# EAGLE schematic Quad (EAGLE 9.5.1)

## Sheet 1 of 2
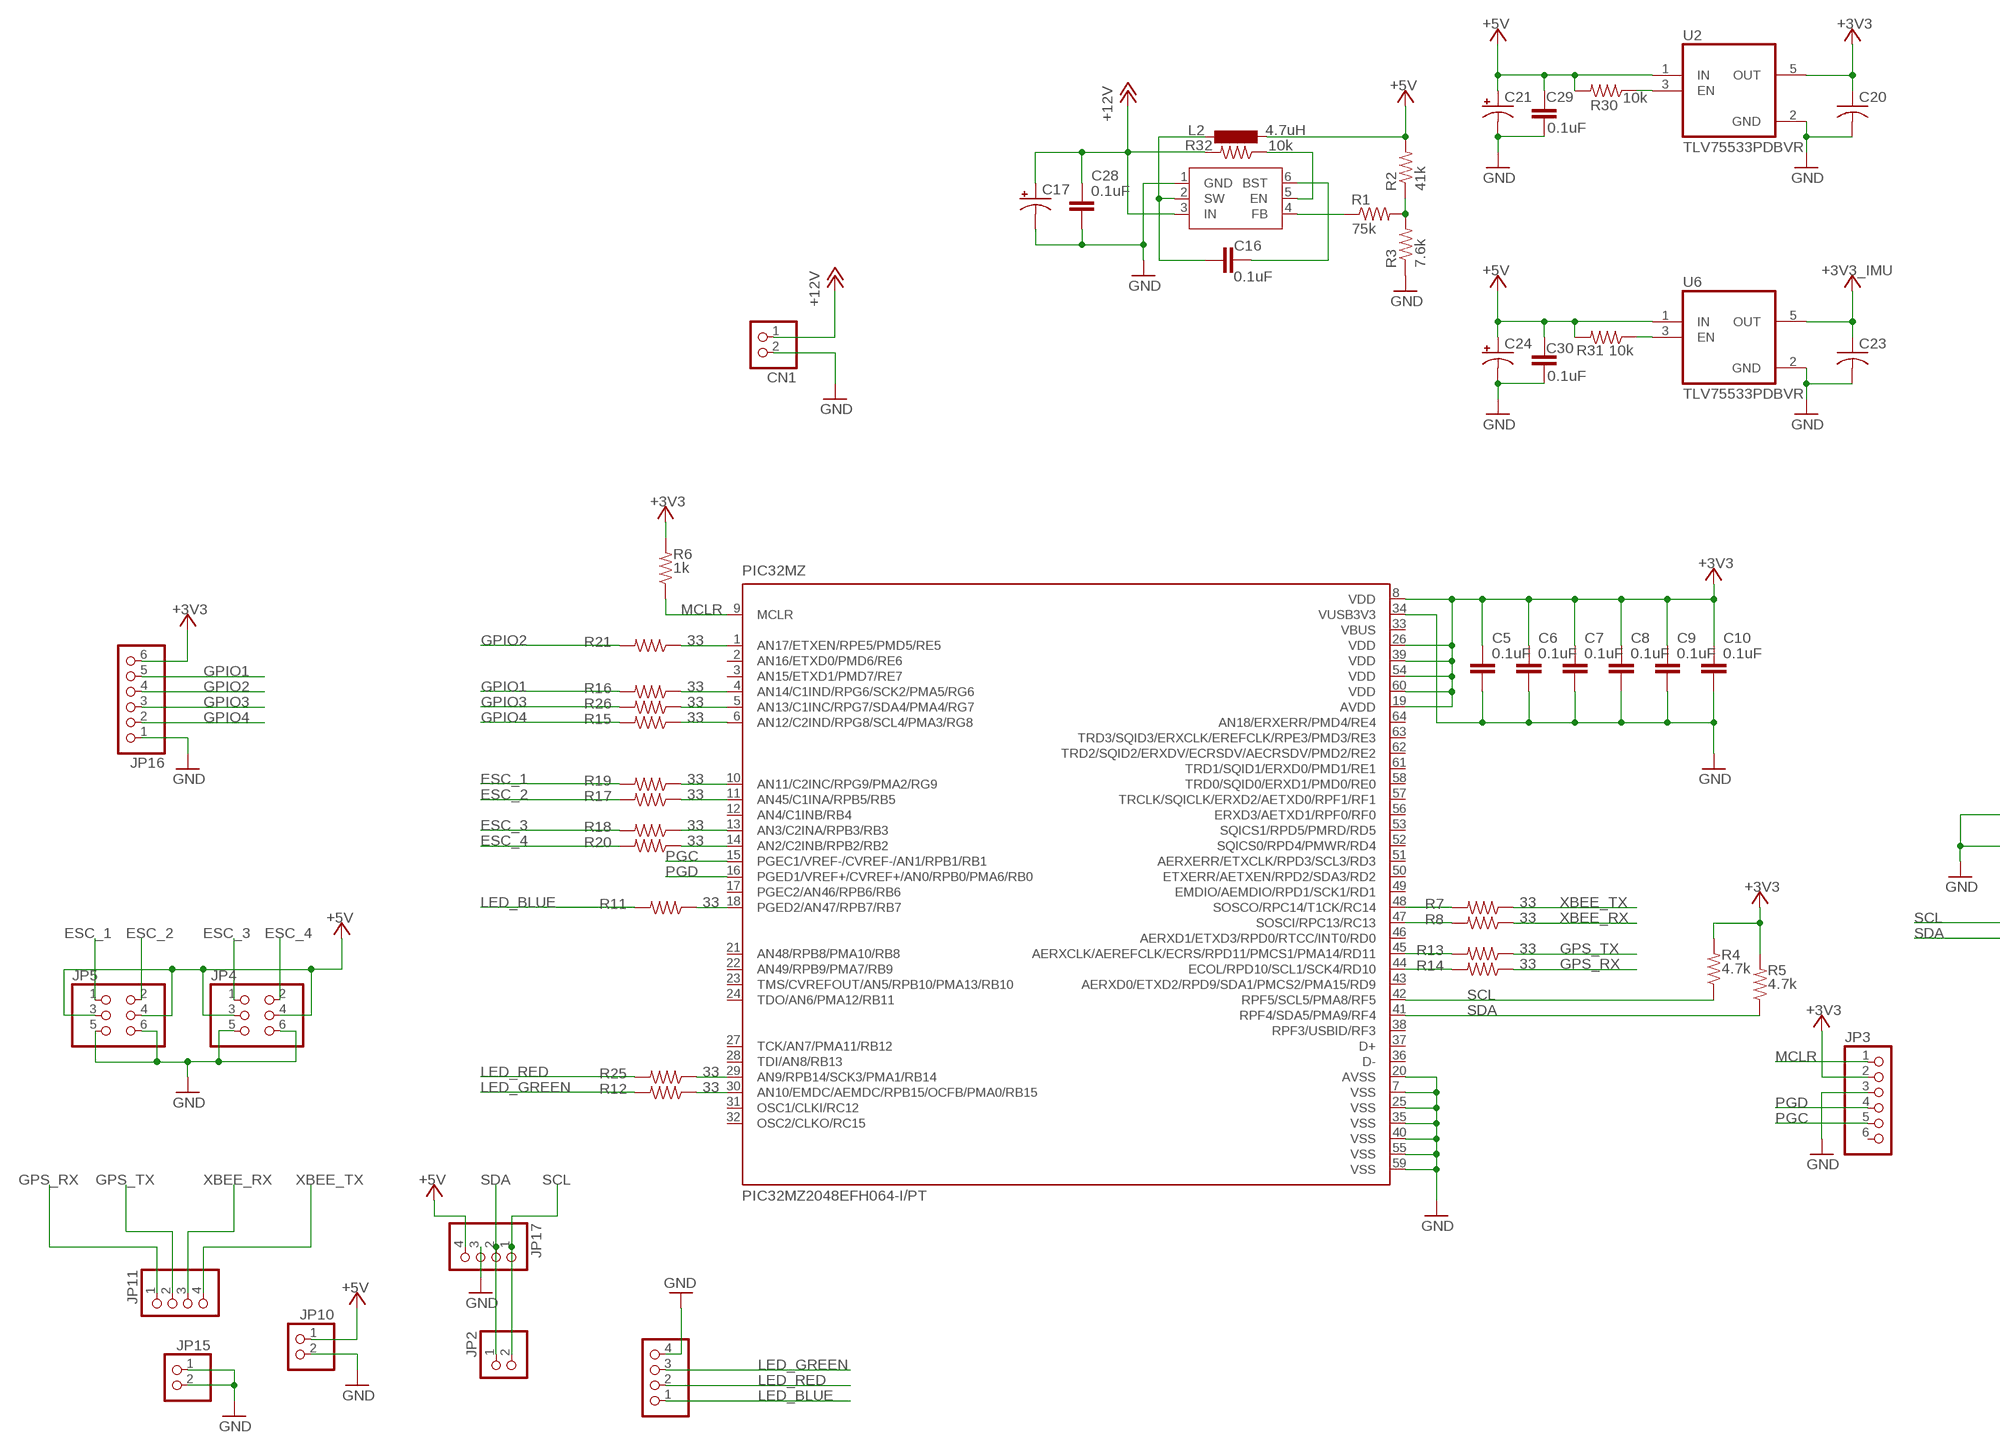
[diagram p0: schematic, sheet 1, part 1 of 2]
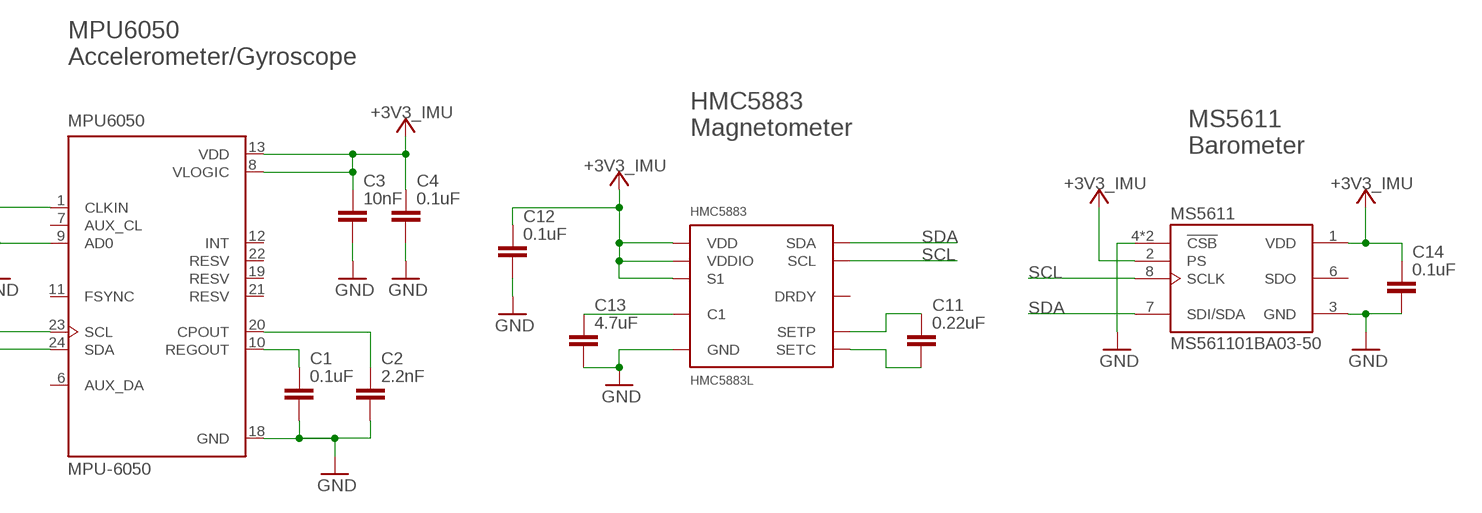
[diagram p1: schematic, sheet 1, part 2 of 2]

### Parts
C1  0.1uF  C-EUC0603  [C0603]
C2  2.2nF  C-EUC0603  [C0603]
C3  10nF  C-EUC0603  [C0603]
C4  0.1uF  C-EUC0603  [C0603]
C5  0.1uF  C-EUC0603  [C0603]
C6  0.1uF  C-EUC0603  [C0603]
C7  0.1uF  C-EUC0603  [C0603]
C8  0.1uF  C-EUC0603  [C0603]
C9  0.1uF  C-EUC0603  [C0603]
C10  0.1uF  C-EUC0603  [C0603]
C11  0.22uF  C-EUC0603  [C0603]
C12  0.1uF  C-EUC0603  [C0603]
C13  4.7uF  C-EUC0603  [C0603]
C14  0.1uF  C-EUC0603  [C0603]
C16  0.1uF  C-EUC0603  [C0603]
C17  CPOL-USC/6032-28R  [C/6032-28R]
C20  C-USC0805  [C0805]
C21  CPOL-USB/3528-21W  [B/3528-21W]
C23  C-USC0805  [C0805]
C24  CPOL-USB/3528-21W  [B/3528-21W]
C28  0.1uF  C-EUC0603  [C0603]
C29  0.1uF  C-EUC0603  [C0603]
C30  0.1uF  C-EUC0603  [C0603]
CN1  JST_2PIN-THM-RA  [JST-PH-2-THM-RA]
HMC5883  HMC5883L  [LPCC-16]
JP2  PINHD-1X2  [1X02]
JP3  PINHD-1X6/90  [1X06/90]
JP4  PINHD-2X3  [2X03]
JP5  PINHD-2X3  [2X03]
JP9  PINHD-1X4  [1X04]
JP10  PINHD-1X2  [1X02]
JP11  PINHD-1X4  [1X04]
JP15  PINHD-1X2  [1X02]
JP16  PINHD-1X6  [1X06]
JP17  PINHD-1X4/90  [1X04/90]
L2  4.7uH  L-EUL2825P  [L2825P]
MPU6050  MPU-6050  [QFN50P400X400X95-24N]
MS5611  MS561101BA03-50  [SON125P500X300X100-8N]
PIC32MZ  PIC32MZ2048EFH064-I/PT  [QFP50P1200X1200X120-64N]
R1  75k  R-US_R0603  [R0603]
R2  41k  R-US_R0603  [R0603]
R3  7.6k  R-US_R0603  [R0603]
R4  4.7k  R-US_R0603  [R0603]
R5  4.7k  R-US_R0603  [R0603]
R6  1k  R-US_R0603  [R0603]
R7  33  R-US_R0603  [R0603]
R8  33  R-US_R0603  [R0603]
R11  33  R-US_R0603  [R0603]
R12  33  R-US_R0603  [R0603]
R13  33  R-US_R0603  [R0603]
R14  33  R-US_R0603  [R0603]
R15  33  R-US_R0603  [R0603]
R16  33  R-US_R0603  [R0603]
R17  33  R-US_R0603  [R0603]
R18  33  R-US_R0603  [R0603]
R19  33  R-US_R0603  [R0603]
R20  33  R-US_R0603  [R0603]
R21  33  R-US_R0603  [R0603]
R25  33  R-US_R0603  [R0603]
R26  33  R-US_R0603  [R0603]
R30  10k  R-US_R0603  [R0603]
R31  10k  R-US_R0603  [R0603]
R32  10k  R-US_R0603  [R0603]
U2  TLV75533PDBVR  [SOT95P280X145-5N]
U6  TLV75533PDBVR  [SOT95P280X145-5N]
U$2  AP65211A  [SOT95P280X140-6N]

### Nets
+3V3: C5.1 C6.1 C7.1 C8.1 C9.1 C10.1 C20.1 JP3.2 JP16.6 PIC32MZ.8(VDD) PIC32MZ.19(AVDD) PIC32MZ.26(VDD) PIC32MZ.39(VDD) PIC32MZ.54(VDD) PIC32MZ.60(VDD) R4.2 R5.2 R6.2 U2.5(OUT)
+5V: C21.+ C24.+ C29.1 C30.1 JP4.3 JP4.4 JP5.3 JP5.4 JP10.1 JP17.4 L2.1 R2.2 R30.2 R31.2 U2.1(IN) U6.1(IN)
+12V: C17.+ C28.1 CN1.1 R32.2 U$2.3(IN)
ESC_1: JP5.1 R19.2
ESC_2: JP5.2 R17.2
ESC_3: JP4.1 R18.2
ESC_4: JP4.2 R20.2
GND: C1.2 C2.2 C3.2 C4.2 C5.2 C6.2 C7.2 C8.2 C9.2 C10.2 C12.2 C13.2 C14.2 C17.- C20.2 C21.- C23.2 C24.- C28.2 C29.2 C30.2 CN1.2 HMC5883.9(GND) HMC5883.11(GND) JP3.3 JP4.5 JP4.6 JP5.5 JP5.6 JP9.4 JP10.2 JP15.1 JP15.2 JP16.1 JP17.3 MPU6050.1(CLKIN) MPU6050.9(AD0) MPU6050.18(GND) MS5611.3(GND) MS5611.4(!CSB) MS5611.5(!CSB) PIC32MZ.7(VSS) PIC32MZ.20(AVSS) PIC32MZ.25(VSS) PIC32MZ.34(VUSB3V3) PIC32MZ.35(VSS) PIC32MZ.40(VSS) PIC32MZ.55(VSS) PIC32MZ.59(VSS) R3.1 U2.2(GND) U6.2(GND) U$2.1(GND)
GPIO1: JP16.5 R16.2
GPIO2: JP16.4 R21.2
GPIO3: JP16.3 R26.2
GPIO4: JP16.2 R15.2
GPS_RX: JP11.1 R14.1
GPS_TX: JP11.2 R13.1
LED_BLUE: JP9.1 R11.2
LED_GREEN: JP9.3 R12.2
LED_RED: JP9.2 R25.2
MCLR: JP3.1 PIC32MZ.9(MCLR) R6.1
N$1: C1.1 MPU6050.10(REGOUT)
N$2: C2.1 MPU6050.20(CPOUT)
N$3: C11.1 HMC5883.8(SETP)
N$4: C11.2 HMC5883.12(SETC)
N$6: C13.1 HMC5883.10(C1)
N$8: C16.1 L2.2 U$2.2(SW)
N$9: C16.2 U$2.6(BST)
N$10: R1.1 U$2.4(FB)
N$11: R1.2 R2.1 R3.2
N$12: PIC32MZ.48(SOSCO/RPC14/T1CK/RC14) R7.2
N$13: PIC32MZ.47(SOSCI/RPC13/RC13) R8.2
N$17: PIC32MZ.18(PGED2/AN47/RPB7/RB7) R11.1
N$18: PIC32MZ.45(AERXCLK/AEREFCLK/ECRS/RPD11/PMCS1/PMA14/RD11) R13.2
N$19: PIC32MZ.44(ECOL/RPD10/SCL1/SCK4/RD10) R14.2
N$20: PIC32MZ.29(AN9/RPB14/SCK3/PMA1/RB14) R25.1
N$21: PIC32MZ.4(AN14/C1IND/RPG6/SCK2/PMA5/RG6) R16.1
N$22: PIC32MZ.1(AN17/ETXEN/RPE5/PMD5/RE5) R21.1
N$23: PIC32MZ.11(AN45/C1INA/RPB5/RB5) R17.1
N$24: PIC32MZ.13(AN3/C2INA/RPB3/RB3) R18.1
N$25: PIC32MZ.10(AN11/C2INC/RPG9/PMA2/RG9) R19.1
N$26: PIC32MZ.14(AN2/C2INB/RPB2/RB2) R20.1
N$30: PIC32MZ.5(AN13/C1INC/RPG7/SDA4/PMA4/RG7) R26.1
N$31: PIC32MZ.6(AN12/C2IND/RPG8/SCL4/PMA3/RG8) R15.1
N$32: R31.1 U6.3(EN)
N$33: R30.1 U2.3(EN)
N$34: PIC32MZ.30(AN10/EMDC/AEMDC/RPB15/OCFB/PMA0/RB15) R12.1
N$36: R32.1 U$2.5(EN)
PGC: JP3.5 PIC32MZ.15(PGEC1/VREF-/CVREF-/AN1/RPB1/RB1)
PGD: JP3.4 PIC32MZ.16(PGED1/VREF+/CVREF+/AN0/RPB0/PMA6/RB0)
SCL: HMC5883.1(SCL) JP2.2 JP17.1 MPU6050.23(SCL) MS5611.8(SCLK) PIC32MZ.42(RPF5/SCL5/PMA8/RF5) R4.1
SDA: HMC5883.16(SDA) JP2.1 JP17.2 MPU6050.24(SDA) MS5611.7(SDI/SDA) PIC32MZ.41(RPF4/SDA5/PMA9/RF4) R5.1
VCC: C3.1 C4.1 C12.1 C14.1 C23.1 HMC5883.2(VDD) HMC5883.4(S1) HMC5883.13(VDDIO) MPU6050.8(VLOGIC) MPU6050.13(VDD) MS5611.1(VDD) MS5611.2(PS) U6.5(OUT) ; supply symbol labelled +3V3_IMU
XBEE_RX: JP11.3 R8.1
XBEE_TX: JP11.4 R7.1
Unconnected: HMC5883.15(DRDY) JP3.6 MPU6050.6(AUX_DA) MPU6050.7(AUX_CL) MPU6050.11(FSYNC) MPU6050.12(INT) MPU6050.19(RESV) MPU6050.21(RESV) MPU6050.22(RESV) MS5611.6(SDO) PIC32MZ.2(AN16/ETXD0/PMD6/RE6) PIC32MZ.3(AN15/ETXD1/PMD7/RE7) PIC32MZ.12(AN4/C1INB/RB4) PIC32MZ.17(PGEC2/AN46/RPB6/RB6) PIC32MZ.21(AN48/RPB8/PMA10/RB8) PIC32MZ.22(AN49/RPB9/PMA7/RB9) PIC32MZ.23(TMS/CVREFOUT/AN5/RPB10/PMA13/RB10) PIC32MZ.24(TDO/AN6/PMA12/RB11) PIC32MZ.27(TCK/AN7/PMA11/RB12) PIC32MZ.28(TDI/AN8/RB13) PIC32MZ.31(OSC1/CLKI/RC12) PIC32MZ.32(OSC2/CLKO/RC15) PIC32MZ.36(D-) PIC32MZ.37(D+) PIC32MZ.38(RPF3/USBID/RF3) PIC32MZ.43(AERXD0/ETXD2/RPD9/SDA1/PMCS2/PMA15/RD9) PIC32MZ.46(AERXD1/ETXD3/RPD0/RTCC/INT0/RD0) PIC32MZ.49(EMDIO/AEMDIO/RPD1/SCK1/RD1) PIC32MZ.50(ETXERR/AETXEN/RPD2/SDA3/RD2) PIC32MZ.51(AERXERR/ETXCLK/RPD3/SCL3/RD3) PIC32MZ.52(SQICS0/RPD4/PMWR/RD4) PIC32MZ.53(SQICS1/RPD5/PMRD/RD5) PIC32MZ.56(ERXD3/AETXD1/RPF0/RF0) PIC32MZ.57(TRCLK/SQICLK/ERXD2/AETXD0/RPF1/RF1) PIC32MZ.58(TRD0/SQID0/ERXD1/PMD0/RE0) PIC32MZ.61(TRD1/SQID1/ERXD0/PMD1/RE1) PIC32MZ.62(TRD2/SQID2/ERXDV/ECRSDV/AECRSDV/PMD2/RE2) PIC32MZ.63(TRD3/SQID3/ERXCLK/EREFCLK/RPE3/PMD3/RE3) PIC32MZ.64(AN18/ERXERR/PMD4/RE4)

### Notes on the sheet
- MPU6050
  Accelerometer/Gyroscope
- HMC5883
  Magnetometer
- MS5611
  Barometer

## Sheet 2 of 2
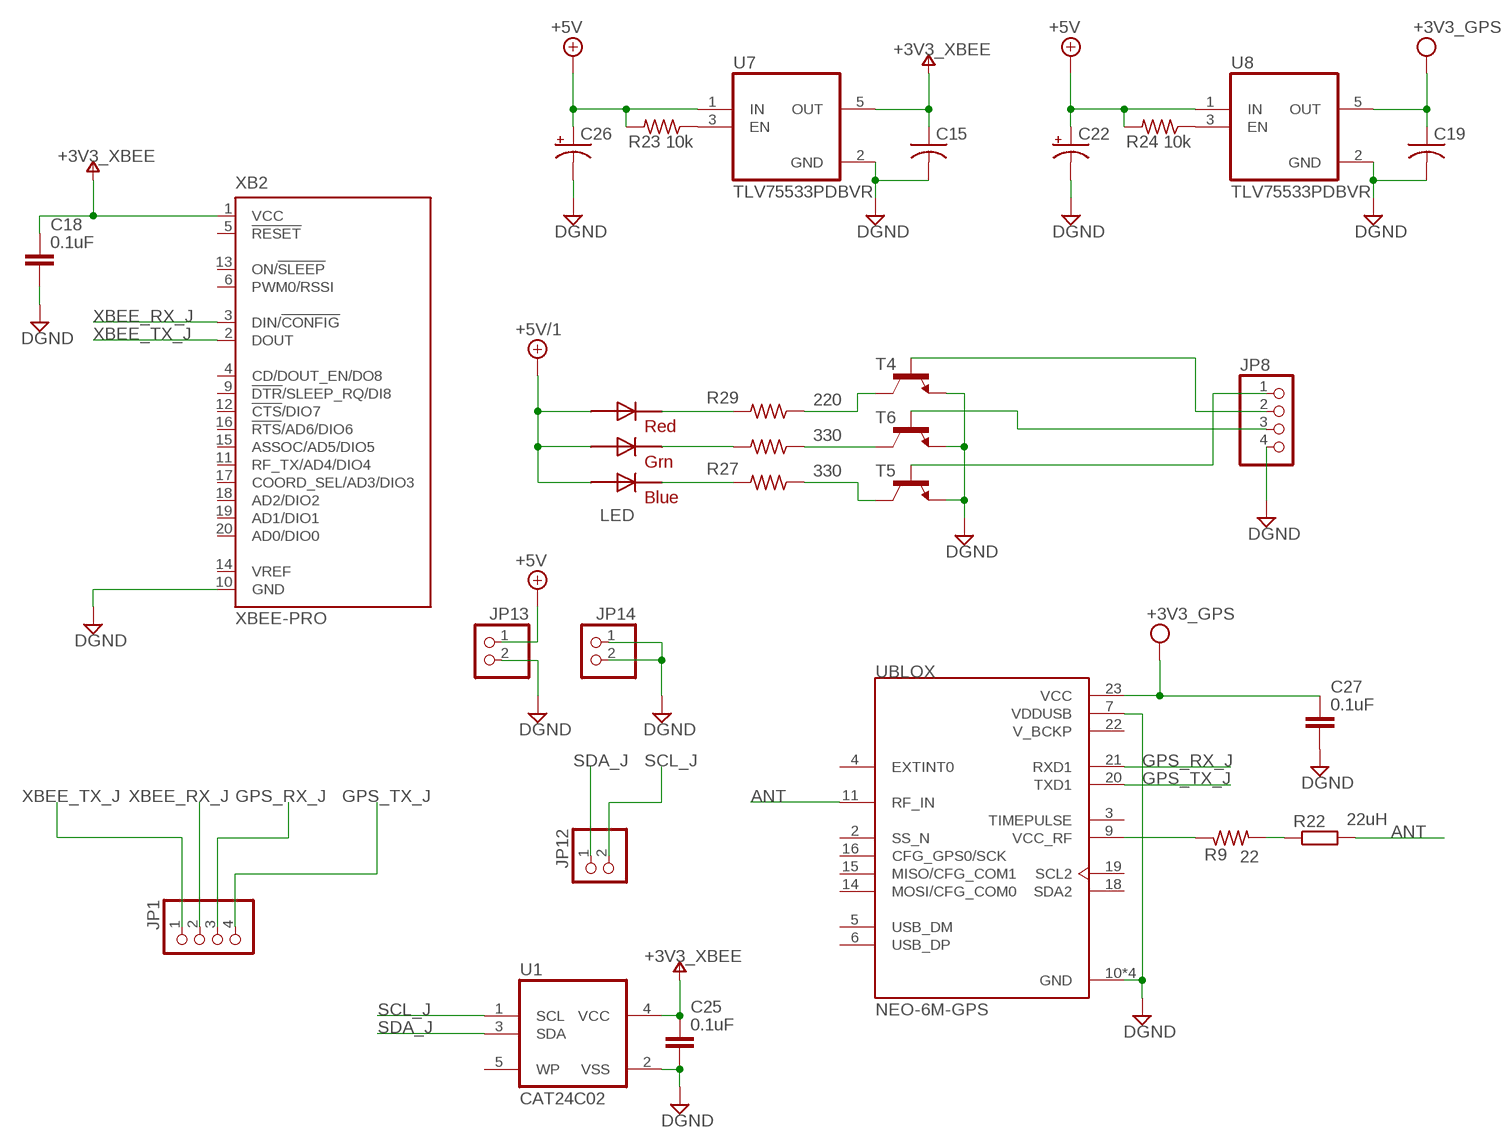
[diagram p2: schematic, sheet 2]

### Parts
C15  C-USC0805  [C0805]
C18  0.1uF  C-EUC0603  [C0603]
C19  C-USC0805  [C0805]
C22  CPOL-USB/3528-21W  [B/3528-21W]
C25  0.1uF  C-EUC0603  [C0603]
C26  CPOL-USB/3528-21W  [B/3528-21W]
C27  0.1uF  C-EUC0603  [C0603]
JP1  PINHD-1X4  [1X04]
JP8  PINHD-1X4  [1X04]
JP12  PINHD-1X2  [1X02]
JP13  PINHD-1X2  [1X02]
JP14  PINHD-1X2  [1X02]
LED  RGBLED5050  [RGBLED5050]
R9  22  R-US_R0603  [R0603]
R22  22uH  R-EU_R0805  [R0805]
R23  10k  R-US_R0603  [R0603]
R24  10k  R-US_R0603  [R0603]
R27  330  R-US_R0603  [R0603]
R28  330  R-US_R0603  [R0603]
R29  220  R-US_R0603  [R0603]
T4  -NPN-SOT23-EBC  [SOT23-EBC]
T5  -NPN-SOT23-EBC  [SOT23-EBC]
T6  -NPN-SOT23-EBC  [SOT23-EBC]
U1  CAT24C02  [SOT95P280X145-5N]
U7  TLV75533PDBVR  [SOT95P280X145-5N]
U8  TLV75533PDBVR  [SOT95P280X145-5N]
UBLOX  NEO-6M-GPS  [XCVR_NEO-6M-GPS]
XB2  XBEE-PRO  [XBEE-PRO]

### Nets
+5V/1: C22.+ C26.+ JP13.1 LED.1(GREEN_A) LED.2(RED_A) LED.3(BLUE_A) R23.2 R24.2 U7.1(IN) U8.1(IN) ; supply symbol labelled +5V
ANT: R22.2 UBLOX.11(RF_IN)
DGND: C15.2 C18.2 C19.2 C22.- C25.2 C26.- C27.2 JP8.4 JP13.2 JP14.1 JP14.2 T4.E T5.E T6.E U1.2(VSS) U7.2(GND) U8.2(GND) UBLOX.7(VDDUSB) UBLOX.10(GND) UBLOX.12(GND) UBLOX.13(GND) UBLOX.24(GND) XB2.10(GND)
GPS_RX_J: JP1.3 UBLOX.21(RXD1)
GPS_TX_J: JP1.4 UBLOX.20(TXD1)
LED_BLUE1: JP8.1 T5.B
LED_GREEN1: JP8.2 T4.B
N$5: LED.5(RED_C) R29.2
N$7: LED.6(GREEN_C) R28.2
N$14: R9.2 R22.1
N$15: LED.4(BLUE_C) R27.2
N$16: R9.1 UBLOX.9(VCC_RF)
N$27: R23.1 U7.3(EN)
N$28: R24.1 U8.3(EN)
N$35: JP8.3 T6.B
N$42: R28.1 T6.C
N$43: R29.1 T4.C
N$44: R27.1 T5.C
SCL_J: JP12.2 U1.1(SCL)
SDA_J: JP12.1 U1.3(SDA)
V+: C15.1 C18.1 C25.1 U1.4(VCC) U7.5(OUT) XB2.1(VCC) ; supply symbol labelled +3V3_XBEE
VDD: C19.1 C27.1 U8.5(OUT) UBLOX.23(VCC) ; supply symbol labelled +3V3_GPS
XBEE_RX_J: JP1.2 XB2.3(DIN/!CONFIG)
XBEE_TX_J: JP1.1 XB2.2(DOUT)
Unconnected: U1.5(WP) UBLOX.2(SS_N) UBLOX.3(TIMEPULSE) UBLOX.4(EXTINT0) UBLOX.5(USB_DM) UBLOX.6(USB_DP) UBLOX.14(MOSI/CFG_COM0) UBLOX.15(MISO/CFG_COM1) UBLOX.16(CFG_GPS0/SCK) UBLOX.18(SDA2) UBLOX.19(SCL2) XB2.4(CD/DOUT_EN/DO8) XB2.5(!RESET) XB2.6(PWM0/RSSI) XB2.9(!DTR!/SLEEP_RQ/DI8) XB2.11(RF_TX/AD4/DIO4) XB2.12(!CTS!/DIO7) XB2.13(ON/!SLEEP) XB2.14(VREF) XB2.15(ASSOC/AD5/DIO5) XB2.16(!RTS!/AD6/DIO6) XB2.17(COORD_SEL/AD3/DIO3) XB2.18(AD2/DIO2) XB2.19(AD1/DIO1) XB2.20(AD0/DIO0)

## Power pins joined to a net without a drawn wire
V_BCKP: UBLOX.22(V_BCKP)
VBUS: PIC32MZ.33(VBUS)

## Library data of the parts
C1-C14 C16 C18 C25 C27-C30 = rcl:C-EU: CAPACITOR, European symbol; SPICEPREFIX: C
C15 C19 C20 C23 = rcl:C-US: CAPACITOR, American symbol; SPICEPREFIX: C
C17 C21 C22 C24 C26 = rcl:CPOL-US: POLARIZED CAPACITOR, American symbol; SPICEPREFIX: C
CN1 = adafruit:JST_2PIN: JST 2-Pin Connectors of various flavors SMT-RA (S2B-PH-SM4) 4UConnector #17311 SMT (B2B-PH-SM4) THM-RA (S2B-PH) THM (B2B-PH)
HMC5883 = HMC5883L:HMC5883L; AVAILABILITY: Unavailable; DESCRIPTION: Digital Compass +/- 0.8g, Lcc-16; MF: Honeywell Aerospace; MP: HMC5883L-T; PACKAGE: LCC-16 Honeywell; PRICE: None
JP1 JP8 JP9 JP11 JP17 = pinhead:PINHD-1X4: PIN HEADER
JP2 JP10 JP12-JP15 = pinhead:PINHD-1X2: PIN HEADER
JP3 JP16 = pinhead:PINHD-1X6: PIN HEADER
JP4 JP5 = pinhead:PINHD-2X3: PIN HEADER
L2 = rcl:L-EU: INDUCTOR, European symbol; SPICEPREFIX: L
LED = adafruit:RGBLED: For 5050 RGB LEDs, the order of the LEDs may vary from one manufacturer to another!
MPU6050 = MPU-6050:MPU-6050: MPU-6050 Six-Axis (Gyro + Accelerometer) MEMS MotionTracking™ Devices; AVAILABILITY: Unavailable; DESCRIPTION: 3-axis gyroscope, 3-axis accelerometer in a 4x4x0.9 housing; MF: TDK InvenSense; MP: MPU-6050; PACKAGE: QFN-24 InvenSense; PRICE: None
MS5611 = MS561101BA03-50:MS561101BA03-50: BAROMETRIC PRESSURE SENSOR; AVAILABILITY: Unavailable; DESCRIPTION: Pressure Sensor 1.44V to 3.6V 0.01bar to 1.2bar Absolute 8-Pin QFN T/R; MF: TE Connectivity; MP: MS561101BA03-50; PACKAGE: SMD-8 Measurement Specialties; PRICE: None
PIC32MZ = PIC32MZ2048EFH064-I_PT:PIC32MZ2048EFH064-I/PT: PIC32MZ Series 2 MB Flash 512 kB RAM 200 MHz 32-Bit Microcontroller - TQFP-64; DESCRIPTION: PIC32MZ Series 2 MB Flash 512 kB RAM 200 MHz 32-Bit Microcontroller - TQFP-64; DIGI-KEY_PART_NUMBER: PIC32MZ2048EFH064-I/PT-ND; DIGI-KEY_PURCHASE_URL: https://www.digikey.com/product-detail/en/microchip-technology/PIC32MZ2048EFH064-I-PT/PIC32MZ2048EFH064-I-PT-ND/5323563?utm_source=snapeda&utm_medium=aggregator&utm_campaign=symbol; MF: Microchip; MP: PIC32MZ2048EFH064-I/PT; PACKAGE: TQFP-64 Microchip
R1-R9 R11-R21 R23-R32 = rcl:R-US_: RESISTOR, American symbol; SPICEPREFIX: R
R22 = rcl:R-EU_: RESISTOR, European symbol; SPICEPREFIX: R
T4-T6 = transistor:*-NPN-: NPN Transistror BF959 corrected 2008.03.06
U1 = CAT24C02:CAT24C02: 500mA Low-IQ Small-Size Low-Dropout (LDO) Regulator 5-SOT-23 -40 to 125; AVAILABILITY: Unavailable; DESCRIPTION: 500mA Low-IQ Small-Size Low-Dropout _LDO_ Regulator 5-SOT-23 -40 to 125; MF: Texas Instruments; MP: TLV75533PDBVR; PACKAGE: SOT-23 Texas Instruments; PRICE: None
U2 U6-U8 = TLV75533PDBVR:TLV75533PDBVR: 500mA Low-IQ Small-Size Low-Dropout (LDO) Regulator 5-SOT-23 -40 to 125; AVAILABILITY: Unavailable; DESCRIPTION: 500mA Low-IQ Small-Size Low-Dropout _LDO_ Regulator 5-SOT-23 -40 to 125; MF: Texas Instruments; MP: TLV75533PDBVR; PACKAGE: SOT-23 Texas Instruments; PRICE: None
U$2 = SOT95P280X140-6N:AP65211A
UBLOX = NEO-6M-GPS:NEO-6M-GPS: SMD GPS Module;; AVAILABILITY: Unavailable; DESCRIPTION: SMD GPS Module;; MF: u-blox; MP: NEO-6M-GPS; PACKAGE: None; PRICE: None
XB2 = maxstream:XBEE: XBee (TM) /XBee-PRO(TM) OEM RF Modules Source: MaxStream, Inc. xbee_productmanual.pdf; MPN: XBP24-AWI-001; OC_FARNELL: 1337916; OC_NEWARK: 42M2667